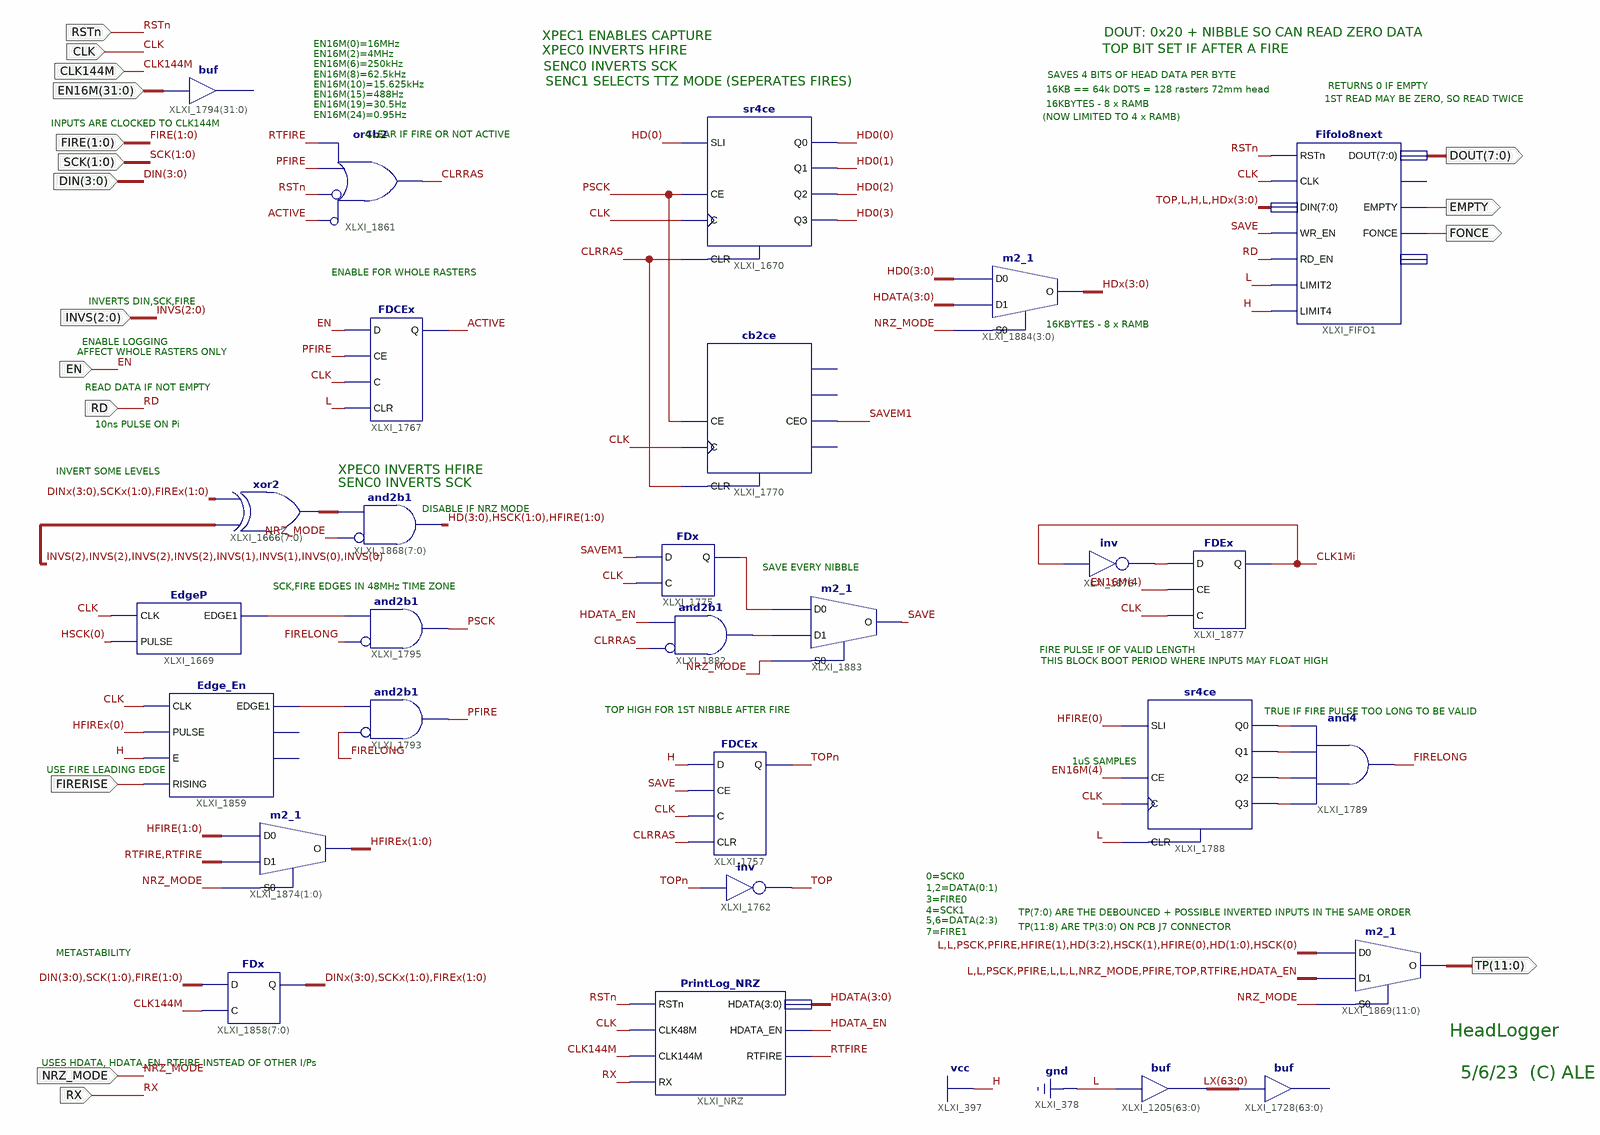
[diagram p0: schematic sheet 1]
// Xilinx ISE schematic HeadLogger - Copy02Bad.sch (spartan3e) as structural Verilog: 28 symbols, 17 ports
module \HeadLogger_-_Copy02Bad  (
  input  CLK,
  input  RSTn,
  input  EN,
  input  [31:0] EN16M,
  input  [3:0] DIN,
  input  CLK144M,
  input  [1:0] FIRE,
  input  [1:0] SCK,
  input  [2:0] INVS,
  input  RD,
  input  NRZ_MODE,
  input  FIRERISE,
  input  RX,
  output [11:0] TP,
  output [7:0] DOUT,
  output EMPTY,
  output FONCE
);

  wire ACTIVE, CLK1Mi, CLRRAS, FIRELONG, HDATA_EN, PFIRE, PSCK, RTFIRE, SAVE, SAVEM1, TOP, TOPn, XLXN_78,
       XLXN_79, XLXN_147, XLXN_167, XLXN_177, XLXN_185, XLXN_186, XLXN_187, XLXN_188;
  wire [1:0] FIREx, HFIRE, HFIREx, HSCK, SCKx;
  wire [3:0] DINx, HD, HD0, HDATA, HDx;
  wire [7:0] XLXN_156;
  wire [63:0] LX;

  // buf XLXI_1794[31..0] has open pins: I=EN16M, O=open
  and XLXI_1795 (PSCK, ~FIRELONG, XLXN_78);  // and2b1
  and XLXI_1793 (PFIRE, ~FIRELONG, XLXN_79);  // and2b1
  EdgeP XLXI_1669 (.CLK(CLK), .EDGE1(XLXN_78), .PULSE(HSCK[0]));
  sr4ce XLXI_1670 (.C(CLK), .CE(PSCK), .CLR(CLRRAS), .SLI(HD[0]), .Q0(HD0[0]), .Q1(HD0[1]), .Q2(HD0[2]), .Q3(HD0[3]));
  cb2ce XLXI_1770 (.C(CLK), .CE(PSCK), .CLR(CLRRAS), .CEO(SAVEM1));  // open: Q0, Q1, TC
  FDx XLXI_1858[7:0] (.C(CLK144M), .D({DIN, SCK, FIRE}), .Q({DINx, SCKx, FIREx}));
  FDCEx XLXI_1767 (.C(CLK), .CE(PFIRE), .CLR(1'b0), .D(EN), .Q(ACTIVE));
  or XLXI_1861 (CLRRAS, ~ACTIVE, ~RSTn, PFIRE, RTFIRE);  // or4b2
  sr4ce XLXI_1788 (
    .C(CLK), .CE(EN16M[4]), .CLR(1'b0), .SLI(HFIRE[0]), .Q0(XLXN_185), .Q1(XLXN_186), .Q2(XLXN_187),
    .Q3(XLXN_188));
  and XLXI_1789 (FIRELONG, XLXN_188, XLXN_187, XLXN_186, XLXN_185);
  FDx XLXI_1775 (.C(CLK), .D(SAVEM1), .Q(XLXN_147));
  Edge_En XLXI_1859 (
    .CLK(CLK), .E(1'b1), .EDGE1(XLXN_79), .PULSE(HFIREx[0]), .RISING(FIRERISE));  // open: EDGE0, EDGEQUICK
  assign XLXN_156 = {{4{INVS[2]}}, {2{INVS[1]}}, {2{INVS[0]}}} ^ {DINx, SCKx, FIREx};  // xor2 XLXI_1666[7..0], 8 bits wide
  assign {HD, HSCK, HFIRE} = ~{8{NRZ_MODE}} & XLXN_156;  // and2b1 XLXI_1868[7..0], 8 bits wide
  m2_1 XLXI_1874[1:0] (.D0(HFIRE), .D1({2{RTFIRE}}), .S0(NRZ_MODE), .O(HFIREx));
  FDEx XLXI_1877 (.C(CLK), .CE(EN16M[4]), .D(XLXN_167), .Q(CLK1Mi));
  not XLXI_1876 (XLXN_167, CLK1Mi);
  m2_1 XLXI_1869[11:0] (
    .D0({2'b00, PSCK, PFIRE, HFIRE[1], HD[3:2], HSCK[1], HFIRE[0], HD[1:0], HSCK[0]}),
    .D1({2'b00, PSCK, PFIRE, 3'b000, NRZ_MODE, PFIRE, TOP, RTFIRE, HDATA_EN}), .S0(NRZ_MODE), .O(TP));
  PrintLog_NRZ XLXI_NRZ (
    .CLK144M(CLK144M), .CLK48M(CLK), .HDATA(HDATA), .HDATA_EN(HDATA_EN), .RSTn(RSTn), .RTFIRE(RTFIRE), .RX(RX));
  assign LX = {64{1'b0}};  // buf XLXI_1205[63..0], 64 bits wide
  // buf XLXI_1728[63..0] has open pins: I=LX, O=open
  and XLXI_1882 (XLXN_177, ~CLRRAS, HDATA_EN);  // and2b1
  FDCEx XLXI_1757 (.C(CLK), .CE(SAVE), .CLR(CLRRAS), .D(1'b1), .Q(TOPn));
  not XLXI_1762 (TOP, TOPn);
  m2_1 XLXI_1883 (.D0(XLXN_147), .D1(XLXN_177), .S0(NRZ_MODE), .O(SAVE));
  m2_1 XLXI_1884[3:0] (.D0(HD0), .D1(HDATA), .S0(NRZ_MODE), .O(HDx));
  FifoIo8next XLXI_FIFO1 (
    .CLK(CLK), .DIN({TOP, 3'b010, HDx}), .DOUT(DOUT), .EMPTY(EMPTY), .FONCE(FONCE), .LIMIT2(1'b0),
    .LIMIT4(1'b1), .RD_EN(RD), .RSTn(RSTn), .WR_EN(SAVE));  // open: FULL, TP

  // Notes on the sheet:
  //   DOUT: 0x20 + NIBBLE SO CAN READ ZERO DATA
  //   XPEC1 ENABLES CAPTURE
  //   EN16M(0)=16MHz
  //   TOP BIT SET IF AFTER A FIRE
  //   XPEC0 INVERTS HFIRE
  //   EN16M(2)=4MHz
  //   EN16M(6)=250kHz
  //   SENC0 INVERTS SCK
  //   EN16M(8)=62.5kHz
  //   SAVES 4 BITS OF HEAD DATA PER BYTE
  //   SENC1 SELECTS TTZ MODE (SEPERATES FIRES)
  //   EN16M(10)=15.625kHz
  //   RETURNS 0 IF EMPTY
  //   16KB == 64k DOTS = 128 rasters 72mm head
  //   EN16M(15)=488Hz
  //   1ST READ MAY BE ZERO, SO READ TWICE
  //   16KBYTES - 8 x RAMB
  //   EN16M(19)=30.5Hz
  //   EN16M(24)=0.95Hz
  //   (NOW LIMITED TO 4 x RAMB)
  //   INPUTS ARE CLOCKED TO CLK144M
  //   CLEAR IF FIRE OR NOT ACTIVE
  //   ENABLE FOR WHOLE RASTERS
  //   INVERTS DIN,SCK,FIRE
  //   16KBYTES - 8 x RAMB
  //   ENABLE LOGGING
  //   AFFECT WHOLE RASTERS ONLY
  //   READ DATA IF NOT EMPTY
  //   10ns PULSE ON Pi
  //   XPEC0 INVERTS HFIRE
  //   INVERT SOME LEVELS
  //   SENC0 INVERTS SCK
  //   DISABLE IF NRZ MODE
  //   SAVE EVERY NIBBLE
  //   SCK,FIRE EDGES IN 48MHz TIME ZONE
  //   FIRE PULSE IF OF VALID LENGTH
  //   THIS BLOCK BOOT PERIOD WHERE INPUTS MAY FLOAT HIGH
  //   TOP HIGH FOR 1ST NIBBLE AFTER FIRE
  //   TRUE IF FIRE PULSE TOO LONG TO BE VALID
  //   1uS SAMPLES
  //   USE FIRE LEADING EDGE
  //   0=SCK0
  //   1,2=DATA(0:1)
  //   3=FIRE0
  //   4=SCK1
  //   TP(7:0) ARE THE DEBOUNCED + POSSIBLE INVERTED INPUTS IN THE SAME ORDER
  //   5,6=DATA(2:3)
  //   TP(11:8) ARE TP(3:0) ON PCB J7 CONNECTOR
  //   7=FIRE1
  //   METASTABILITY
  //   HeadLogger
  //   USES HDATA, HDATA_EN, RTFIRE INSTEAD OF OTHER I/Ps
  //   5/6/23  (C) ALE
endmodule
